# Altium schematic sheet STM_32.SchDoc
size A4; SheetNumber: 1; SheetTotal: 9
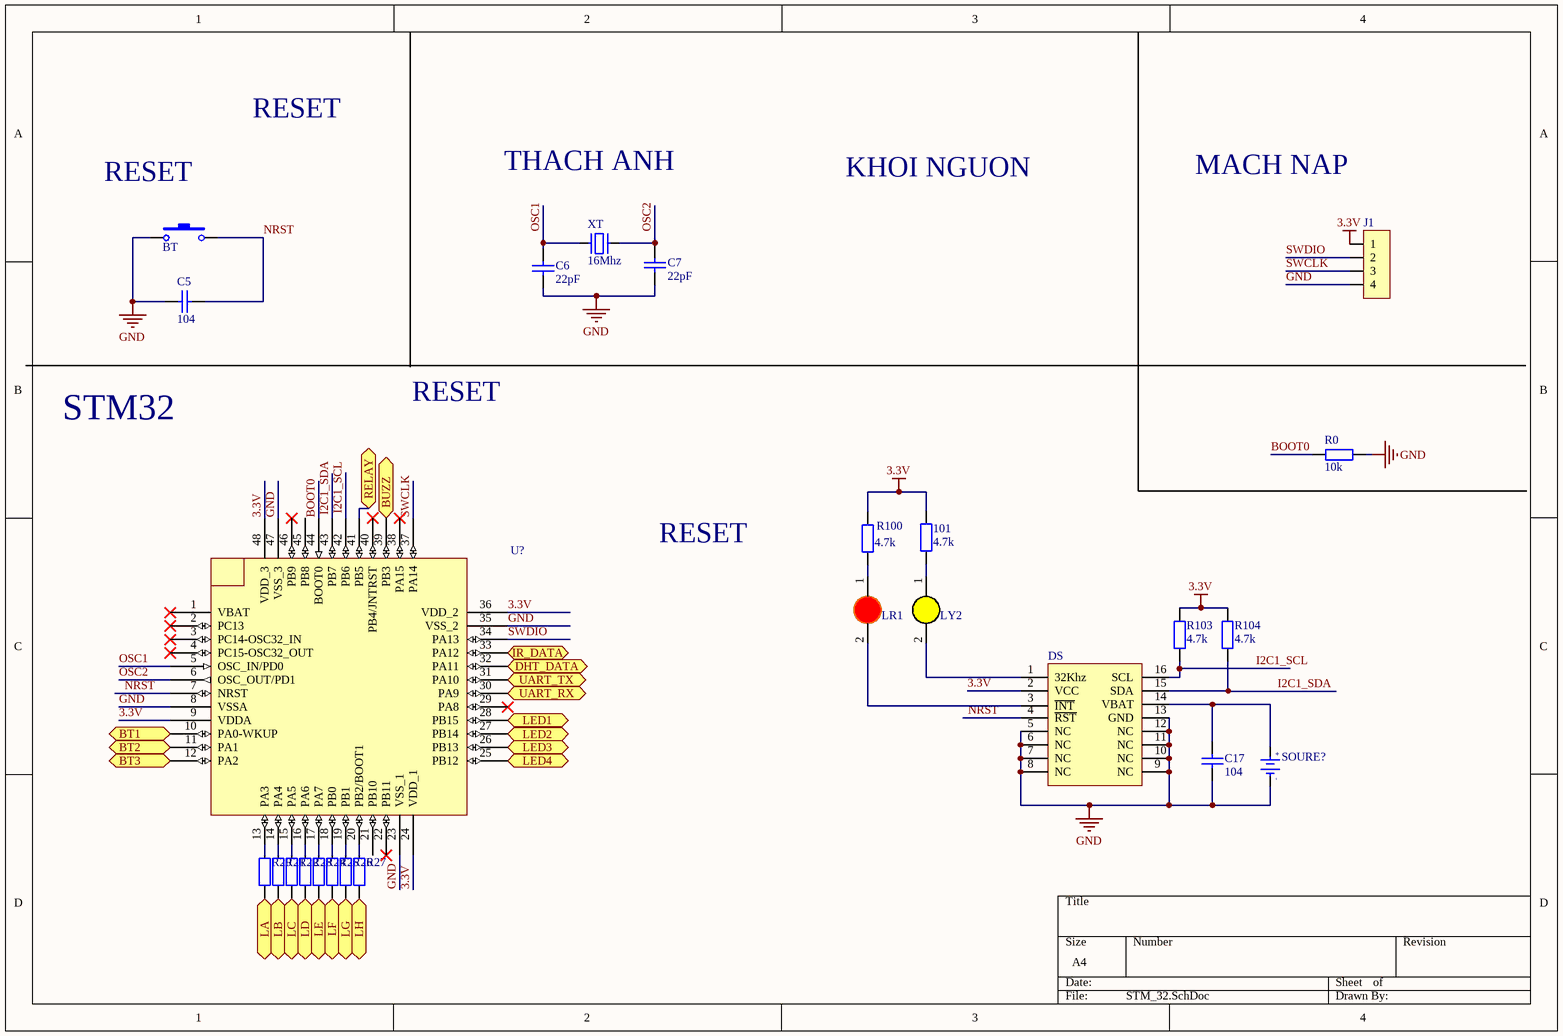
[diagram p0: STM_32.SchDoc]

## Parts
101  4.7k  [tro smd 0603]
BT  Nut Nhan 2 Chan SMD 3x6x2.5  [Nut Nhan 2 Chan SMD 3x6x2.5]  (value not drawn)
C5  104  [tu 0603]
C6  22pF  [tu 0603]
C7  22pF  [tu 0603]
C17  104  [tu 0603]
DS  DS3231 SMD  [SOIC 16]  (value not drawn)
J1  JP 1x4 2.54  [JP 1x4 CT]  (value not drawn)
LR1  LED 0805  [LED-0805-Red]  (value not drawn)
LY2  LED 0805  [LED-0805-Yellow]  (value not drawn)
R0  10k  [tro smd 0603]
R20  10k  [tro smd 0603]  (value not drawn)
R21  10k  [tro smd 0603]  (value not drawn)
R22  10k  [tro smd 0603]  (value not drawn)
R23  10k  [tro smd 0603]  (value not drawn)
R24  10k  [tro smd 0603]  (value not drawn)
R25  10k  [tro smd 0603]  (value not drawn)
R26  10k  [tro smd 0603]  (value not drawn)
R27  10k  [tro smd 0603]  (value not drawn)
R100  4.7k  [tro smd 0603]
R103  4.7k  [tro smd 0603]
R104  4.7k  [tro smd 0603]
SOURE?  CR1220 SMD  [DE PIN CR1220]  (value not drawn)
U?  STM32F103xx_LQFP48  [STM32_LQPF48]  (value not drawn)
XT  16Mhz  [Thach Anh 2 chan SMD]

## Ports
BT1 (bidir), BT2 (bidir), BT3 (bidir), BUZZ (bidir), DHT_DATA (bidir), IR_DATA (bidir), LA (bidir), LB (bidir), LC (bidir), LD (bidir), LE (bidir), LED1 (bidir), LED2 (bidir), LED3 (bidir), LED4 (bidir), LF (bidir), LG (bidir), LH (bidir), RELAY (bidir), UART_RX (bidir), UART_TX (bidir)

## Nets
3.3V: 101.2 DS.2(VCC) J1.1 R100.2 R103.2 R104.2 U?.9(VDDA) U?.24(VDD_1) U?.36(VDD_2) U?.48(VDD_3)
GND: BT.1 C5.2 C6.2 C7.2 C17.2 DS.5(NC) DS.6(NC) DS.7(NC) DS.8(NC) DS.9(NC) DS.10(NC) DS.11(NC) DS.12(NC) DS.13(GND) J1.4 R0.2 SOURE?.2(GND) U?.8(VSSA) U?.23(VSS_1) U?.35(VSS_2) U?.47(VSS_3)
BOOT0: R0.1 U?.44(BOOT0)
BT1: U?.10(PA0-WKUP) ; port BT1
BT2: U?.11(PA1) ; port BT2
BT3: U?.12(PA2) ; port BT3
BUZZ: U?.39(PB3) ; port BUZZ
DHT_DATA: U?.32(PA11) ; port DHT_DATA
I2C1_SCL: DS.16(SCL) R103.1 U?.42(PB6)
I2C1_SDA: DS.15(SDA) R104.1 U?.43(PB7)
IR_DATA: U?.33(PA12) ; port IR_DATA
LA: R20.2 ; port LA
LB: R21.2 ; port LB
LC: R22.2 ; port LC
LD: R23.2 ; port LD
LE: R24.2 ; port LE
LED1: U?.28(PB15) ; port LED1
LED2: U?.27(PB14) ; port LED2
LED3: U?.26(PB13) ; port LED3
LED4: U?.25(PB12) ; port LED4
LF: R25.2 ; port LF
LG: R26.2 ; port LG
LH: R27.2 ; port LH
NRST: BT.2 C5.1 DS.4(~{RST}) U?.7(NRST)
OSC1: C6.1 U?.5(OSC_IN/PD0) XT.1
OSC2: C7.1 U?.6(OSC_OUT/PD1) XT.2
RELAY: U?.41(PB5) ; port RELAY
SWCLK: J1.3 U?.37(PA14)
SWDIO: J1.2 U?.34(PA13)
UART_RX: U?.30(PA9) ; port UART_RX
UART_TX: U?.31(PA10) ; port UART_TX
Net101_1: 101.1 LY2.1(A)
NetC17_1: C17.1 DS.14(VBAT) SOURE?.1(+3V)
NetDS_1: DS.1(32Khz) LY2.2(K)
NetDS_3: DS.3(~{INT}) LR1.2(K)
NetLR1_1: LR1.1(A) R100.1
NetR20_1: R20.1 U?.13(PA3)
NetR21_1: R21.1 U?.14(PA4)
NetR22_1: R22.1 U?.15(PA5)
NetR23_1: R23.1 U?.16(PA6)
NetR24_1: R24.1 U?.17(PA7)
NetR25_1: R25.1 U?.18(PB0)
NetR26_1: R26.1 U?.19(PB1)
NetR27_1: R27.1 U?.20(PB2/BOOT1)

Not connected (* = marked no-connect by the designer): U? 1(VBAT)* 2(PC13)* 3(PC14-OSC32_IN)* 4(PC15-OSC32_OUT)* 21(PB10) 22(PB11)* 29(PA8)* 38(PA15)* 40(PB4/JNTRST)* 45(PB8) 46(PB9)*

## Notes on the sheet
- RESET
- THACH ANH
- KHOI NGUON
- MACH NAP
- (near BT) RESET
- STM32
- (in symbol De pin CR1220 SMD) +; -

## Library data of the parts
101 R100 R103 R104 = Tro 0603 5% 4.7k: Dán; Don_Vi: Con; So_Chan: 2; Ten_Linh_Kien: Trở 0603 5% 4.7k; Ma_Hang: MH006327; Chung_Loai: Dán; Kieu_Chan: *
BT = Nut Nhan 2 Chan SMD 3x6x2.5: Ma_Hang: MH001036; Ten: Nút Nhấn 2 Chân 3x6x2.5MM SMD
C5 C17 = Tu 0603 104 50V 10%: Dán; Don_Vi: Con; So_Chan: 2; Ten_Linh_Kien: Tụ 0603 104-100nF 10% 50V; Ma_Hang: MH004568; Chung_Loai: Dán; Kieu_Chan: *
C6 C7 = Tu 0603 22pF 50V 10%: Dán; Don_Vi: Con; So_Chan: 2; Ten_Linh_Kien: Tụ 0603 22pF 50V 10%; Ma_Hang: MH004570; Chung_Loai: Dán; Kieu_Chan: *
DS = DS3231 SMD: SOIC
J1 = JP 1x4 2.54 Cai Thang: Cắm; Ten_Linh_Kien: Jump Đơn Cái 2.54MM 1x20P Thẳng; Don_Vi: Con; Ma_Hang: MH004006; Ghi_Chu: *; Kieu_Chan: *; Chung_Loai: Cắm
LR1 = LED 0805 Do: Dán; Don_Vi: Con; Ma_Hang: MH000897; Ten_Linh_Kien: LED 0805 Màu Đỏ (Red); Ghi_Chu: *; Kieu_Chan: *; Chung_Loai: Dán
LY2 = LED 0805 Vang: Dán; Don_Vi: Con; Ma_Hang: MH002329; Ten_Linh_Kien: LED 0805 Màu Vàng ( Yellow); Ghi_Chu: *; Kieu_Chan: *; Chung_Loai: Dán
R0 R20-R27 = Tro 0603 1% 10k: Dán; Don_Vi: Con; So_Chan: 2; Ten_Linh_Kien: Trở 0603 1% 10k; Ma_Hang: MH006333; Chung_Loai: Dán; Kieu_Chan: *
SOURE? = De pin CR1220 SMD: Ten: Đế PIN CR1220 SMD; Ma_Hang: MH000833
XT = Thach Anh 2 chan SMD: Crystal For all Crystal 2pin.; Value: 4Mhz
U? = STM32F103xx_LQFP48: Published: 30-May-2008; DatasheetVersion: rev6, Mar-2008; PackageVersion: Mar-2008; PackageReference: LQFP48; Publisher: Altium Limited; PackageDescription: 48-Pin Low-Profile Quad Flat Pack, 7 x 7 mm Body, 0.5 mm Pitch (LQFP48); ComponentLink1Description: Manufacturer Link; ComponentLink1URL: www.st.com/stm32; ComponentLink2Description: Datasheet; ComponentLink2URL: http://www.st.com/stonline/products/literature/ds/13587.pdf